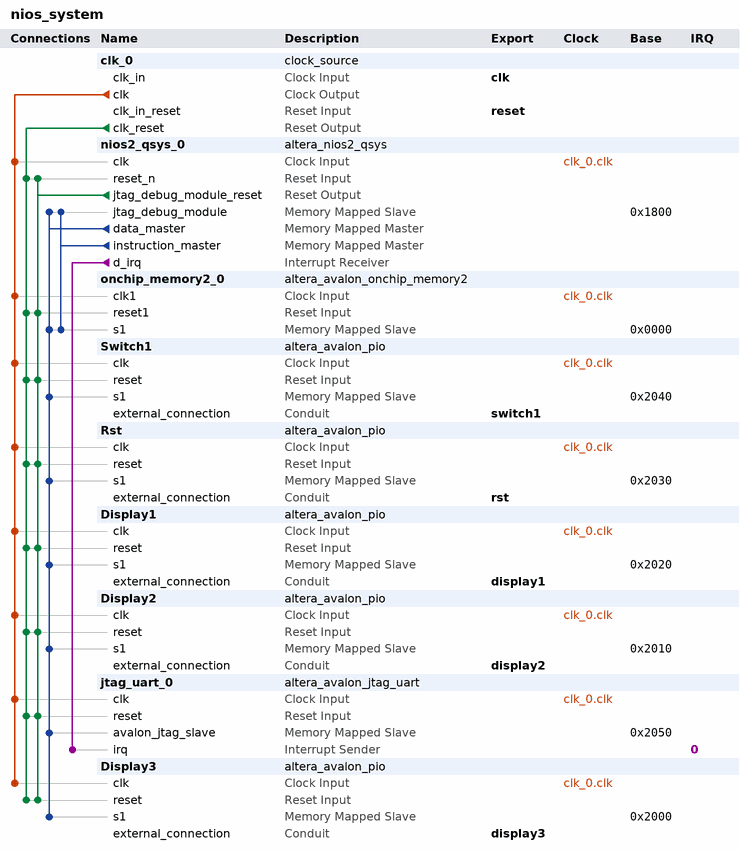
[diagram p0: system contents]
# Platform Designer (Qsys) system nios_system, Cyclone II EP2C35F672C6
# Parameters at their usual value, and those the tool derives, are not listed.
package require -exact qsys 13.0.1
create_system nios_system
set_project_property DEVICE_FAMILY {Cyclone II}
set_project_property DEVICE EP2C35F672C6

add_instance clk_0 clock_source 13.0
set_instance_parameter_value clk_0 clockFrequency 50000000

add_instance nios2_qsys_0 altera_nios2_qsys 13.0
set_instance_parameter_value nios2_qsys_0 resetSlave onchip_memory2_0.s1
set_instance_parameter_value nios2_qsys_0 mmu_TLBMissExcSlave None
set_instance_parameter_value nios2_qsys_0 exceptionSlave onchip_memory2_0.s1
set_instance_parameter_value nios2_qsys_0 breakSlave nios2_qsys_0.jtag_debug_module
set_instance_parameter_value nios2_qsys_0 impl Tiny
set_instance_parameter_value nios2_qsys_0 icache_size 4096

add_instance onchip_memory2_0 altera_avalon_onchip_memory2 13.0.1
set_instance_parameter_value onchip_memory2_0 dataWidth 32
set_instance_parameter_value onchip_memory2_0 dualPort false
set_instance_parameter_value onchip_memory2_0 initMemContent true
set_instance_parameter_value onchip_memory2_0 initializationFileName onchip_mem.hex
set_instance_parameter_value onchip_memory2_0 memorySize 4096

add_instance Switch1 altera_avalon_pio 13.0.1
set_instance_parameter_value Switch1 direction Input
set_instance_parameter_value Switch1 width 3

add_instance Rst altera_avalon_pio 13.0.1
set_instance_parameter_value Rst direction Input
set_instance_parameter_value Rst width 1

add_instance Display1 altera_avalon_pio 13.0.1
set_instance_parameter_value Display1 direction Output
set_instance_parameter_value Display1 width 7

add_instance Display2 altera_avalon_pio 13.0.1
set_instance_parameter_value Display2 direction Output
set_instance_parameter_value Display2 width 7

add_instance jtag_uart_0 altera_avalon_jtag_uart 13.0.1
set_instance_parameter_value jtag_uart_0 simInteractiveOptions NO_INTERACTIVE_WINDOWS

add_instance Display3 altera_avalon_pio 13.0.1
set_instance_parameter_value Display3 direction Output
set_instance_parameter_value Display3 width 7

# connections
add_connection clk_0.clk Display1.clk clock
add_connection clk_0.clk Display2.clk clock
add_connection clk_0.clk Display3.clk clock
add_connection clk_0.clk jtag_uart_0.clk clock
add_connection clk_0.clk nios2_qsys_0.clk clock
add_connection clk_0.clk onchip_memory2_0.clk1 clock
add_connection clk_0.clk Rst.clk clock
add_connection clk_0.clk Switch1.clk clock
add_connection clk_0.clk_reset Display1.reset reset
add_connection clk_0.clk_reset Display2.reset reset
add_connection clk_0.clk_reset Display3.reset reset
add_connection clk_0.clk_reset jtag_uart_0.reset reset
add_connection clk_0.clk_reset nios2_qsys_0.reset_n reset
add_connection clk_0.clk_reset onchip_memory2_0.reset1 reset
add_connection clk_0.clk_reset Rst.reset reset
add_connection clk_0.clk_reset Switch1.reset reset
add_connection nios2_qsys_0.jtag_debug_module_reset Display1.reset reset
add_connection nios2_qsys_0.jtag_debug_module_reset Display2.reset reset
add_connection nios2_qsys_0.jtag_debug_module_reset Display3.reset reset
add_connection nios2_qsys_0.jtag_debug_module_reset jtag_uart_0.reset reset
add_connection nios2_qsys_0.jtag_debug_module_reset nios2_qsys_0.reset_n reset
add_connection nios2_qsys_0.jtag_debug_module_reset onchip_memory2_0.reset1 reset
add_connection nios2_qsys_0.jtag_debug_module_reset Rst.reset reset
add_connection nios2_qsys_0.jtag_debug_module_reset Switch1.reset reset
add_connection nios2_qsys_0.data_master Display1.s1 avalon
set_connection_parameter_value nios2_qsys_0.data_master/Display1.s1 baseAddress 0x2020
add_connection nios2_qsys_0.data_master Display2.s1 avalon
set_connection_parameter_value nios2_qsys_0.data_master/Display2.s1 baseAddress 0x2010
add_connection nios2_qsys_0.data_master Display3.s1 avalon
set_connection_parameter_value nios2_qsys_0.data_master/Display3.s1 baseAddress 0x2000
add_connection nios2_qsys_0.data_master jtag_uart_0.avalon_jtag_slave avalon
set_connection_parameter_value nios2_qsys_0.data_master/jtag_uart_0.avalon_jtag_slave baseAddress 0x2050
add_connection nios2_qsys_0.data_master nios2_qsys_0.jtag_debug_module avalon
set_connection_parameter_value nios2_qsys_0.data_master/nios2_qsys_0.jtag_debug_module baseAddress 0x1800
add_connection nios2_qsys_0.data_master onchip_memory2_0.s1 avalon
set_connection_parameter_value nios2_qsys_0.data_master/onchip_memory2_0.s1 baseAddress 0x0000
add_connection nios2_qsys_0.data_master Rst.s1 avalon
set_connection_parameter_value nios2_qsys_0.data_master/Rst.s1 baseAddress 0x2030
add_connection nios2_qsys_0.data_master Switch1.s1 avalon
set_connection_parameter_value nios2_qsys_0.data_master/Switch1.s1 baseAddress 0x2040
add_connection nios2_qsys_0.instruction_master nios2_qsys_0.jtag_debug_module avalon
set_connection_parameter_value nios2_qsys_0.instruction_master/nios2_qsys_0.jtag_debug_module baseAddress 0x1800
add_connection nios2_qsys_0.instruction_master onchip_memory2_0.s1 avalon
set_connection_parameter_value nios2_qsys_0.instruction_master/onchip_memory2_0.s1 baseAddress 0x0000
add_connection nios2_qsys_0.d_irq jtag_uart_0.irq interrupt
set_connection_parameter_value nios2_qsys_0.d_irq/jtag_uart_0.irq irqNumber 0

# exported interfaces
add_interface clk clock sink
set_interface_property clk EXPORT_OF clk_0.clk_in
add_interface reset reset sink
set_interface_property reset EXPORT_OF clk_0.clk_in_reset
add_interface switch1 conduit end
set_interface_property switch1 EXPORT_OF Switch1.external_connection
add_interface rst conduit end
set_interface_property rst EXPORT_OF Rst.external_connection
add_interface display1 conduit end
set_interface_property display1 EXPORT_OF Display1.external_connection
add_interface display2 conduit end
set_interface_property display2 EXPORT_OF Display2.external_connection
add_interface display3 conduit end
set_interface_property display3 EXPORT_OF Display3.external_connection

set_interconnect_requirement {$system} qsys_mm.clockCrossingAdapter HANDSHAKE
set_interconnect_requirement {$system} qsys_mm.maxAdditionalLatency 1

save_system nios_system.qsys
